# EAGLE design ai_hat_stellar (EAGLE 7.1.0)
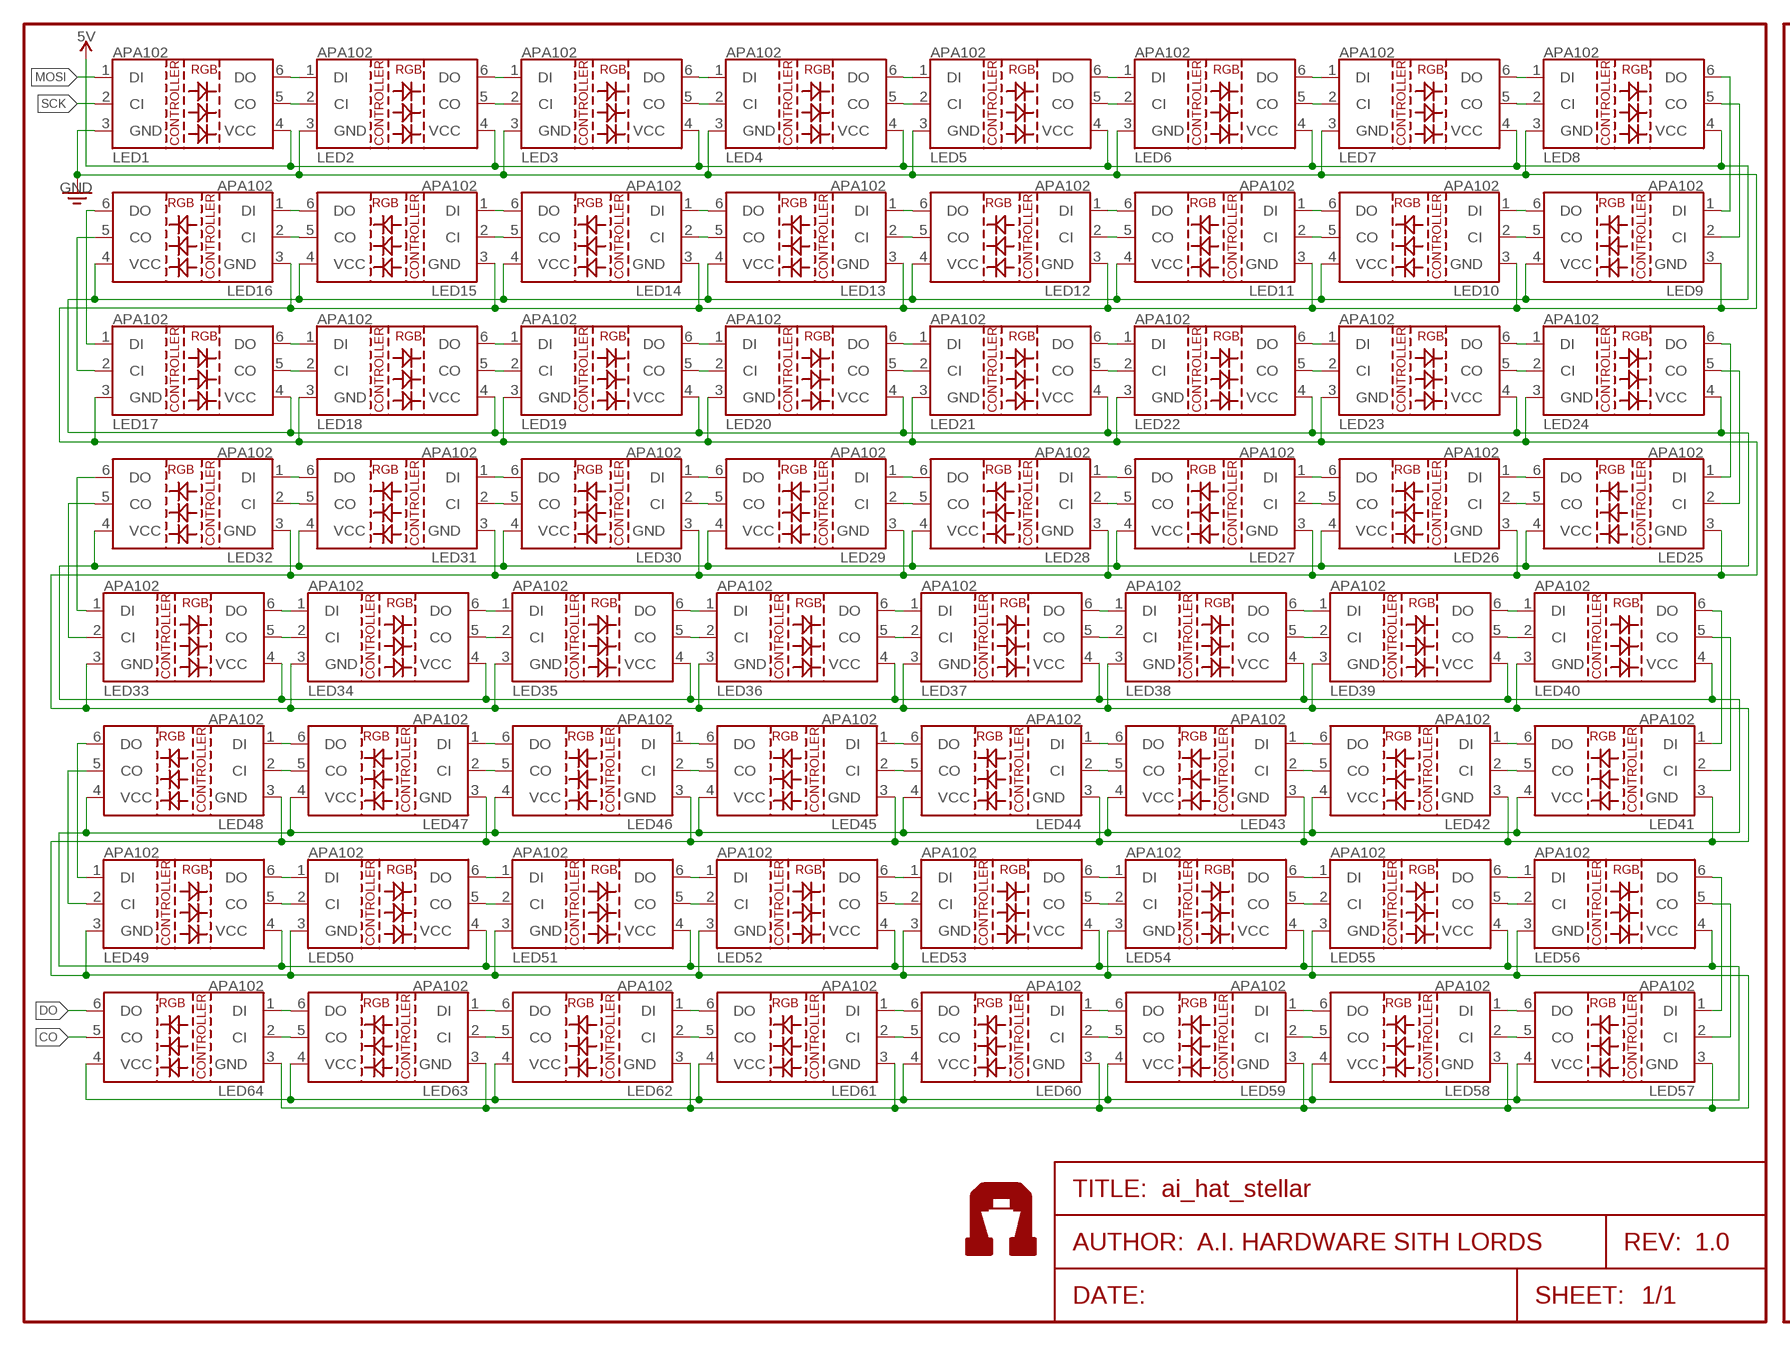
[diagram p0: schematic, sheet 1, part 1 of 2]
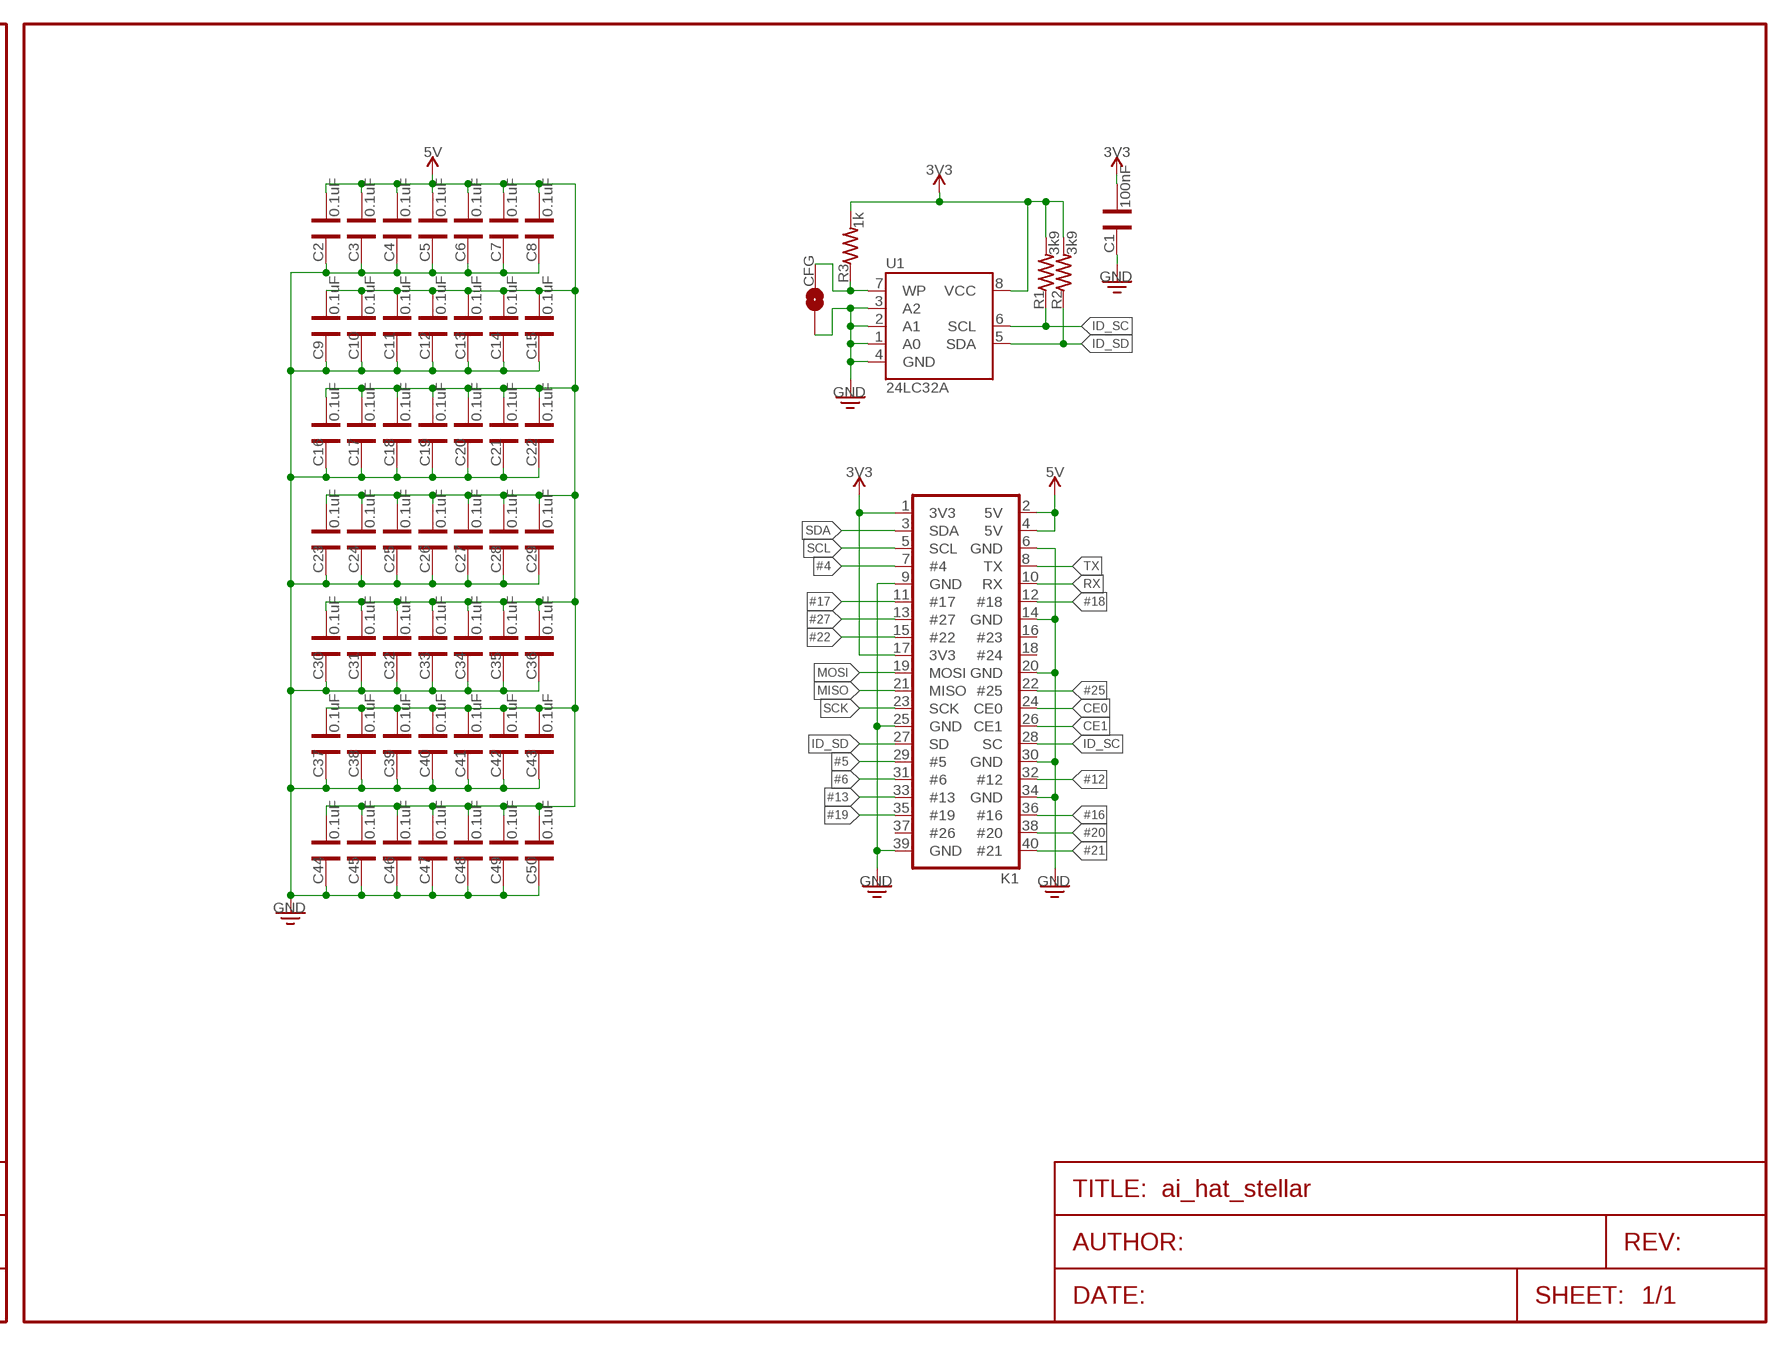
[diagram p1: schematic, sheet 1, part 2 of 2]
FRAME1 (FRAME-LETTER): AUTHOR: A.I. HARDWARE SITH LORDS; REV: 1.0

## Parts
C1  100nF  CAP0603  [CAP-0603]
C2  0.1uF  CAP0603  [CAP-0603]
C3  0.1uF  CAP0603  [CAP-0603]
C4  0.1uF  CAP0603  [CAP-0603]
C5  0.1uF  CAP0603  [CAP-0603]
C6  0.1uF  CAP0603  [CAP-0603]
C7  0.1uF  CAP0603  [CAP-0603]
C8  0.1uF  CAP0603  [CAP-0603]
C9  0.1uF  CAP0603  [CAP-0603]
C10  0.1uF  CAP0603  [CAP-0603]
C11  0.1uF  CAP0603  [CAP-0603]
C12  0.1uF  CAP0603  [CAP-0603]
C13  0.1uF  CAP0603  [CAP-0603]
C14  0.1uF  CAP0603  [CAP-0603]
C15  0.1uF  CAP0603  [CAP-0603]
C16  0.1uF  CAP0603  [CAP-0603]
C17  0.1uF  CAP0603  [CAP-0603]
C18  0.1uF  CAP0603  [CAP-0603]
C19  0.1uF  CAP0603  [CAP-0603]
C20  0.1uF  CAP0603  [CAP-0603]
C21  0.1uF  CAP0603  [CAP-0603]
C22  0.1uF  CAP0603  [CAP-0603]
C23  0.1uF  CAP0603  [CAP-0603]
C24  0.1uF  CAP0603  [CAP-0603]
C25  0.1uF  CAP0603  [CAP-0603]
C26  0.1uF  CAP0603  [CAP-0603]
C27  0.1uF  CAP0603  [CAP-0603]
C28  0.1uF  CAP0603  [CAP-0603]
C29  0.1uF  CAP0603  [CAP-0603]
C30  0.1uF  CAP0603  [CAP-0603]
C31  0.1uF  CAP0603  [CAP-0603]
C32  0.1uF  CAP0603  [CAP-0603]
C33  0.1uF  CAP0603  [CAP-0603]
C34  0.1uF  CAP0603  [CAP-0603]
C35  0.1uF  CAP0603  [CAP-0603]
C36  0.1uF  CAP0603  [CAP-0603]
C37  0.1uF  CAP0603  [CAP-0603]
C38  0.1uF  CAP0603  [CAP-0603]
C39  0.1uF  CAP0603  [CAP-0603]
C40  0.1uF  CAP0603  [CAP-0603]
C41  0.1uF  CAP0603  [CAP-0603]
C42  0.1uF  CAP0603  [CAP-0603]
C43  0.1uF  CAP0603  [CAP-0603]
C44  0.1uF  CAP0603  [CAP-0603]
C45  0.1uF  CAP0603  [CAP-0603]
C46  0.1uF  CAP0603  [CAP-0603]
C47  0.1uF  CAP0603  [CAP-0603]
C48  0.1uF  CAP0603  [CAP-0603]
C49  0.1uF  CAP0603  [CAP-0603]
C50  0.1uF  CAP0603  [CAP-0603]
CFG  1X02-SJ-NO  [1X02-SJ-NO]
K1  2X20-RPI  [2X20-RPI]
LED1  LED-APA102  [LED-APA102]
LED2  LED-APA102  [LED-APA102]
LED3  LED-APA102  [LED-APA102]
LED4  LED-APA102  [LED-APA102]
LED5  LED-APA102  [LED-APA102]
LED6  LED-APA102  [LED-APA102]
LED7  LED-APA102  [LED-APA102]
LED8  LED-APA102  [LED-APA102]
LED9  LED-APA102  [LED-APA102]
LED10  LED-APA102  [LED-APA102]
LED11  LED-APA102  [LED-APA102]
LED12  LED-APA102  [LED-APA102]
LED13  LED-APA102  [LED-APA102]
LED14  LED-APA102  [LED-APA102]
LED15  LED-APA102  [LED-APA102]
LED16  LED-APA102  [LED-APA102]
LED17  LED-APA102  [LED-APA102]
LED18  LED-APA102  [LED-APA102]
LED19  LED-APA102  [LED-APA102]
LED20  LED-APA102  [LED-APA102]
LED21  LED-APA102  [LED-APA102]
LED22  LED-APA102  [LED-APA102]
LED23  LED-APA102  [LED-APA102]
LED24  LED-APA102  [LED-APA102]
LED25  LED-APA102  [LED-APA102]
LED26  LED-APA102  [LED-APA102]
LED27  LED-APA102  [LED-APA102]
LED28  LED-APA102  [LED-APA102]
LED29  LED-APA102  [LED-APA102]
LED30  LED-APA102  [LED-APA102]
LED31  LED-APA102  [LED-APA102]
LED32  LED-APA102  [LED-APA102]
LED33  LED-APA102  [LED-APA102]
LED34  LED-APA102  [LED-APA102]
LED35  LED-APA102  [LED-APA102]
LED36  LED-APA102  [LED-APA102]
LED37  LED-APA102  [LED-APA102]
LED38  LED-APA102  [LED-APA102]
LED39  LED-APA102  [LED-APA102]
LED40  LED-APA102  [LED-APA102]
LED41  LED-APA102  [LED-APA102]
LED42  LED-APA102  [LED-APA102]
LED43  LED-APA102  [LED-APA102]
LED44  LED-APA102  [LED-APA102]
LED45  LED-APA102  [LED-APA102]
LED46  LED-APA102  [LED-APA102]
LED47  LED-APA102  [LED-APA102]
LED48  LED-APA102  [LED-APA102]
LED49  LED-APA102  [LED-APA102]
LED50  LED-APA102  [LED-APA102]
LED51  LED-APA102  [LED-APA102]
LED52  LED-APA102  [LED-APA102]
LED53  LED-APA102  [LED-APA102]
LED54  LED-APA102  [LED-APA102]
LED55  LED-APA102  [LED-APA102]
LED56  LED-APA102  [LED-APA102]
LED57  LED-APA102  [LED-APA102]
LED58  LED-APA102  [LED-APA102]
LED59  LED-APA102  [LED-APA102]
LED60  LED-APA102  [LED-APA102]
LED61  LED-APA102  [LED-APA102]
LED62  LED-APA102  [LED-APA102]
LED63  LED-APA102  [LED-APA102]
LED64  LED-APA102  [LED-APA102]
R1  3k9  RES0603  [RES-0603]
R2  3k9  RES0603  [RES-0603]
R3  1k  RES0603  [RES-0603]
U1  24LC32A  [SO08-EIAJ]
U$9  AI-LOGOXS  [AI-LOGO-XS]
U$10  AI-LOGOXS  [AI-LOGO-XS]

## Nets
3V3: C1.1 K1.1(3V3) K1.17(3V3) R1.2 R2.2 R3.2 U1.8(VCC)
5V: C2.1 C3.1 C4.1 C5.1 C6.1 C7.1 C8.1 C9.1 C10.1 C11.1 C12.1 C13.1 C14.1 C15.1 C16.1 C17.1 C18.1 C19.1 C20.1 C21.1 C22.1 C23.1 C24.1 C25.1 C26.1 C27.1 C28.1 C29.1 C30.1 C31.1 C32.1 C33.1 C34.1 C35.1 C36.1 C37.1 C38.1 C39.1 C40.1 C41.1 C42.1 C43.1 C44.1 C45.1 C46.1 C47.1 C48.1 C49.1 C50.1 K1.2(5V) K1.4(5V) LED1.4(VCC) LED2.4(VCC) LED3.4(VCC) LED4.4(VCC) LED5.4(VCC) LED6.4(VCC) LED7.4(VCC) LED8.4(VCC) LED9.4(VCC) LED10.4(VCC) LED11.4(VCC) LED12.4(VCC) LED13.4(VCC) LED14.4(VCC) LED15.4(VCC) LED16.4(VCC) LED17.4(VCC) LED18.4(VCC) LED19.4(VCC) LED20.4(VCC) LED21.4(VCC) LED22.4(VCC) LED23.4(VCC) LED24.4(VCC) LED25.4(VCC) LED26.4(VCC) LED27.4(VCC) LED28.4(VCC) LED29.4(VCC) LED30.4(VCC) LED31.4(VCC) LED32.4(VCC) LED33.4(VCC) LED34.4(VCC) LED35.4(VCC) LED36.4(VCC) LED37.4(VCC) LED38.4(VCC) LED39.4(VCC) LED40.4(VCC) LED41.4(VCC) LED42.4(VCC) LED43.4(VCC) LED44.4(VCC) LED45.4(VCC) LED46.4(VCC) LED47.4(VCC) LED48.4(VCC) LED49.4(VCC) LED50.4(VCC) LED51.4(VCC) LED52.4(VCC) LED53.4(VCC) LED54.4(VCC) LED55.4(VCC) LED56.4(VCC) LED57.4(VCC) LED58.4(VCC) LED59.4(VCC) LED60.4(VCC) LED61.4(VCC) LED62.4(VCC) LED63.4(VCC) LED64.4(VCC)
#4: K1.7(#4)
#5: K1.29(#5)
#6: K1.31(#6)
#12: K1.32(#12)
#13: K1.33(#13)
#16: K1.36(#16)
#17: K1.11(#17)
#18: K1.12(#18)
#19: K1.35(#19)
#20: K1.38(#20)
#21: K1.40(#21)
#22: K1.15(#22)
#25: K1.22(#25)
#27: K1.13(#27)
CE0: K1.24(CE0)
CE1: K1.26(CE1)
CO: LED64.5(CO)
DO: LED64.6(DO)
GND: C1.2 C2.2 C3.2 C4.2 C5.2 C6.2 C7.2 C8.2 C9.2 C10.2 C11.2 C12.2 C13.2 C14.2 C15.2 C16.2 C17.2 C18.2 C19.2 C20.2 C21.2 C22.2 C23.2 C24.2 C25.2 C26.2 C27.2 C28.2 C29.2 C30.2 C31.2 C32.2 C33.2 C34.2 C35.2 C36.2 C37.2 C38.2 C39.2 C40.2 C41.2 C42.2 C43.2 C44.2 C45.2 C46.2 C47.2 C48.2 C49.2 C50.2 CFG.1 K1.6(GND) K1.9(GND) K1.14(GND) K1.20(GND) K1.25(GND) K1.30(GND) K1.34(GND) K1.39(GND) LED1.3(GND) LED2.3(GND) LED3.3(GND) LED4.3(GND) LED5.3(GND) LED6.3(GND) LED7.3(GND) LED8.3(GND) LED9.3(GND) LED10.3(GND) LED11.3(GND) LED12.3(GND) LED13.3(GND) LED14.3(GND) LED15.3(GND) LED16.3(GND) LED17.3(GND) LED18.3(GND) LED19.3(GND) LED20.3(GND) LED21.3(GND) LED22.3(GND) LED23.3(GND) LED24.3(GND) LED25.3(GND) LED26.3(GND) LED27.3(GND) LED28.3(GND) LED29.3(GND) LED30.3(GND) LED31.3(GND) LED32.3(GND) LED33.3(GND) LED34.3(GND) LED35.3(GND) LED36.3(GND) LED37.3(GND) LED38.3(GND) LED39.3(GND) LED40.3(GND) LED41.3(GND) LED42.3(GND) LED43.3(GND) LED44.3(GND) LED45.3(GND) LED46.3(GND) LED47.3(GND) LED48.3(GND) LED49.3(GND) LED50.3(GND) LED51.3(GND) LED52.3(GND) LED53.3(GND) LED54.3(GND) LED55.3(GND) LED56.3(GND) LED57.3(GND) LED58.3(GND) LED59.3(GND) LED60.3(GND) LED61.3(GND) LED62.3(GND) LED63.3(GND) LED64.3(GND) U1.1(A0) U1.2(A1) U1.3(A2) U1.4(GND)
ID_SC: K1.28(SC) R1.1 U1.6(SCL)
ID_SD: K1.27(SD) R2.1 U1.5(SDA)
MISO: K1.21(MISO)
MOSI: K1.19(MOSI) LED1.1(DI)
N$1: LED8.5(CO) LED9.2(CI)
N$2: LED9.5(CO) LED10.2(CI)
N$3: CFG.2 R3.1 U1.7(WP)
N$4: LED8.6(DO) LED9.1(DI)
N$5: LED1.5(CO) LED2.2(CI)
N$6: LED1.6(DO) LED2.1(DI)
N$7: LED2.6(DO) LED3.1(DI)
N$8: LED2.5(CO) LED3.2(CI)
N$9: LED3.6(DO) LED4.1(DI)
N$10: LED3.5(CO) LED4.2(CI)
N$11: LED4.6(DO) LED5.1(DI)
N$12: LED4.5(CO) LED5.2(CI)
N$13: LED5.6(DO) LED6.1(DI)
N$14: LED5.5(CO) LED6.2(CI)
N$15: LED6.6(DO) LED7.1(DI)
N$16: LED6.5(CO) LED7.2(CI)
N$17: LED7.6(DO) LED8.1(DI)
N$18: LED7.5(CO) LED8.2(CI)
N$19: LED9.6(DO) LED10.1(DI)
N$20: LED10.6(DO) LED11.1(DI)
N$21: LED10.5(CO) LED11.2(CI)
N$22: LED11.6(DO) LED12.1(DI)
N$23: LED11.5(CO) LED12.2(CI)
N$24: LED12.6(DO) LED13.1(DI)
N$25: LED12.5(CO) LED13.2(CI)
N$26: LED13.6(DO) LED14.1(DI)
N$27: LED13.5(CO) LED14.2(CI)
N$28: LED14.6(DO) LED15.1(DI)
N$29: LED14.5(CO) LED15.2(CI)
N$30: LED15.6(DO) LED16.1(DI)
N$31: LED15.5(CO) LED16.2(CI)
N$32: LED17.5(CO) LED18.2(CI)
N$33: LED17.6(DO) LED18.1(DI)
N$34: LED18.6(DO) LED19.1(DI)
N$35: LED18.5(CO) LED19.2(CI)
N$36: LED19.6(DO) LED20.1(DI)
N$37: LED19.5(CO) LED20.2(CI)
N$38: LED20.6(DO) LED21.1(DI)
N$39: LED20.5(CO) LED21.2(CI)
N$40: LED21.6(DO) LED22.1(DI)
N$41: LED21.5(CO) LED22.2(CI)
N$42: LED22.6(DO) LED23.1(DI)
N$43: LED22.5(CO) LED23.2(CI)
N$44: LED23.6(DO) LED24.1(DI)
N$45: LED23.5(CO) LED24.2(CI)
N$46: LED16.6(DO) LED17.1(DI)
N$47: LED25.5(CO) LED26.2(CI)
N$48: LED25.6(DO) LED26.1(DI)
N$49: LED26.6(DO) LED27.1(DI)
N$50: LED26.5(CO) LED27.2(CI)
N$51: LED27.6(DO) LED28.1(DI)
N$52: LED27.5(CO) LED28.2(CI)
N$53: LED28.6(DO) LED29.1(DI)
N$54: LED28.5(CO) LED29.2(CI)
N$55: LED29.6(DO) LED30.1(DI)
N$56: LED29.5(CO) LED30.2(CI)
N$57: LED30.6(DO) LED31.1(DI)
N$58: LED30.5(CO) LED31.2(CI)
N$59: LED31.6(DO) LED32.1(DI)
N$60: LED31.5(CO) LED32.2(CI)
N$61: LED16.5(CO) LED17.2(CI)
N$62: LED33.5(CO) LED34.2(CI)
N$63: LED33.6(DO) LED34.1(DI)
N$64: LED34.6(DO) LED35.1(DI)
N$65: LED34.5(CO) LED35.2(CI)
N$66: LED35.6(DO) LED36.1(DI)
N$67: LED35.5(CO) LED36.2(CI)
N$68: LED36.6(DO) LED37.1(DI)
N$69: LED36.5(CO) LED37.2(CI)
N$70: LED37.6(DO) LED38.1(DI)
N$71: LED37.5(CO) LED38.2(CI)
N$72: LED38.6(DO) LED39.1(DI)
N$73: LED38.5(CO) LED39.2(CI)
N$74: LED39.6(DO) LED40.1(DI)
N$75: LED39.5(CO) LED40.2(CI)
N$76: LED24.6(DO) LED25.1(DI)
N$77: LED41.5(CO) LED42.2(CI)
N$78: LED41.6(DO) LED42.1(DI)
N$79: LED42.6(DO) LED43.1(DI)
N$80: LED42.5(CO) LED43.2(CI)
N$81: LED43.6(DO) LED44.1(DI)
N$82: LED43.5(CO) LED44.2(CI)
N$83: LED44.6(DO) LED45.1(DI)
N$84: LED44.5(CO) LED45.2(CI)
N$85: LED45.6(DO) LED46.1(DI)
N$86: LED45.5(CO) LED46.2(CI)
N$87: LED46.6(DO) LED47.1(DI)
N$88: LED46.5(CO) LED47.2(CI)
N$89: LED47.6(DO) LED48.1(DI)
N$90: LED47.5(CO) LED48.2(CI)
N$91: LED49.5(CO) LED50.2(CI)
N$92: LED49.6(DO) LED50.1(DI)
N$93: LED50.6(DO) LED51.1(DI)
N$94: LED50.5(CO) LED51.2(CI)
N$95: LED51.6(DO) LED52.1(DI)
N$96: LED51.5(CO) LED52.2(CI)
N$97: LED52.6(DO) LED53.1(DI)
N$98: LED52.5(CO) LED53.2(CI)
N$99: LED53.6(DO) LED54.1(DI)
N$100: LED53.5(CO) LED54.2(CI)
N$101: LED54.6(DO) LED55.1(DI)
N$102: LED54.5(CO) LED55.2(CI)
N$103: LED55.6(DO) LED56.1(DI)
N$104: LED55.5(CO) LED56.2(CI)
N$105: LED32.5(CO) LED33.2(CI)
N$106: LED57.5(CO) LED58.2(CI)
N$107: LED57.6(DO) LED58.1(DI)
N$108: LED58.6(DO) LED59.1(DI)
N$109: LED58.5(CO) LED59.2(CI)
N$110: LED59.6(DO) LED60.1(DI)
N$111: LED59.5(CO) LED60.2(CI)
N$112: LED60.6(DO) LED61.1(DI)
N$113: LED60.5(CO) LED61.2(CI)
N$114: LED61.6(DO) LED62.1(DI)
N$115: LED61.5(CO) LED62.2(CI)
N$116: LED62.6(DO) LED63.1(DI)
N$117: LED62.5(CO) LED63.2(CI)
N$118: LED63.6(DO) LED64.1(DI)
N$119: LED63.5(CO) LED64.2(CI)
N$120: LED32.6(DO) LED33.1(DI)
N$121: LED40.6(DO) LED41.1(DI)
N$122: LED40.5(CO) LED41.2(CI)
N$123: LED48.6(DO) LED49.1(DI)
N$124: LED24.5(CO) LED25.2(CI)
N$125: LED48.5(CO) LED49.2(CI)
N$126: LED56.6(DO) LED57.1(DI)
N$127: LED56.5(CO) LED57.2(CI)
RX: K1.10(RX)
SCK: K1.23(SCK) LED1.2(CI)
SCL: K1.5(SCL)
SDA: K1.3(SDA)
TX: K1.8(TX)
Unconnected: K1.16(#23) K1.18(#24) K1.37(#26)

## Library data of the parts
C1 = Ai_Passives:CAP; DIELECTRIC: X7R
C2-C50 = Ai_Passives:CAP
CFG = Ai_Connectors:1X02-SJ-NO: Solder Jumper SMD solder jumper: Normally Open and Normally Closed are the same, but have different paste layers. NC will have a large amount of paste and should jumper during reflow.
K1 = Ai_Connectors:2X20-RPI
LED1-LED64 = Ai_LED:LED-APA102
R1-R3 = Ai_Passives:RES: Part # blah Digikey; TOLERANCE: 5%
U1 = Ai_IC:24LC32A
U$9 U$10 = Ai_Miscellany:AI-LOGO

## Board
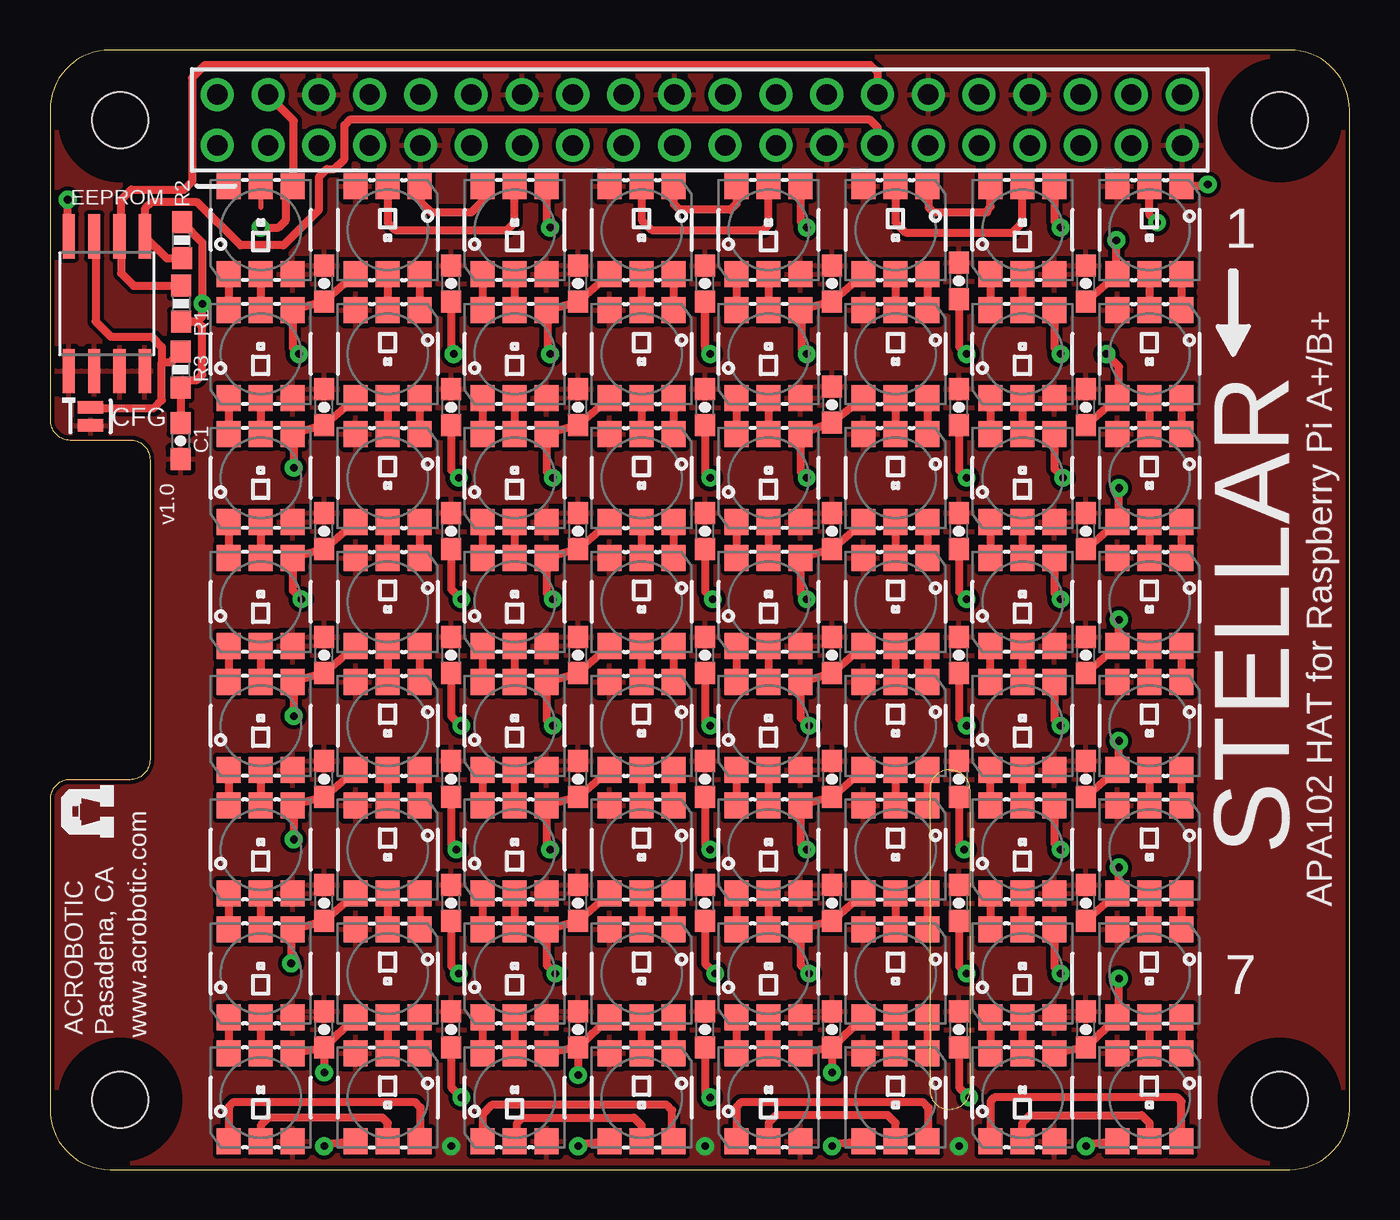
[diagram p2: board, top side]
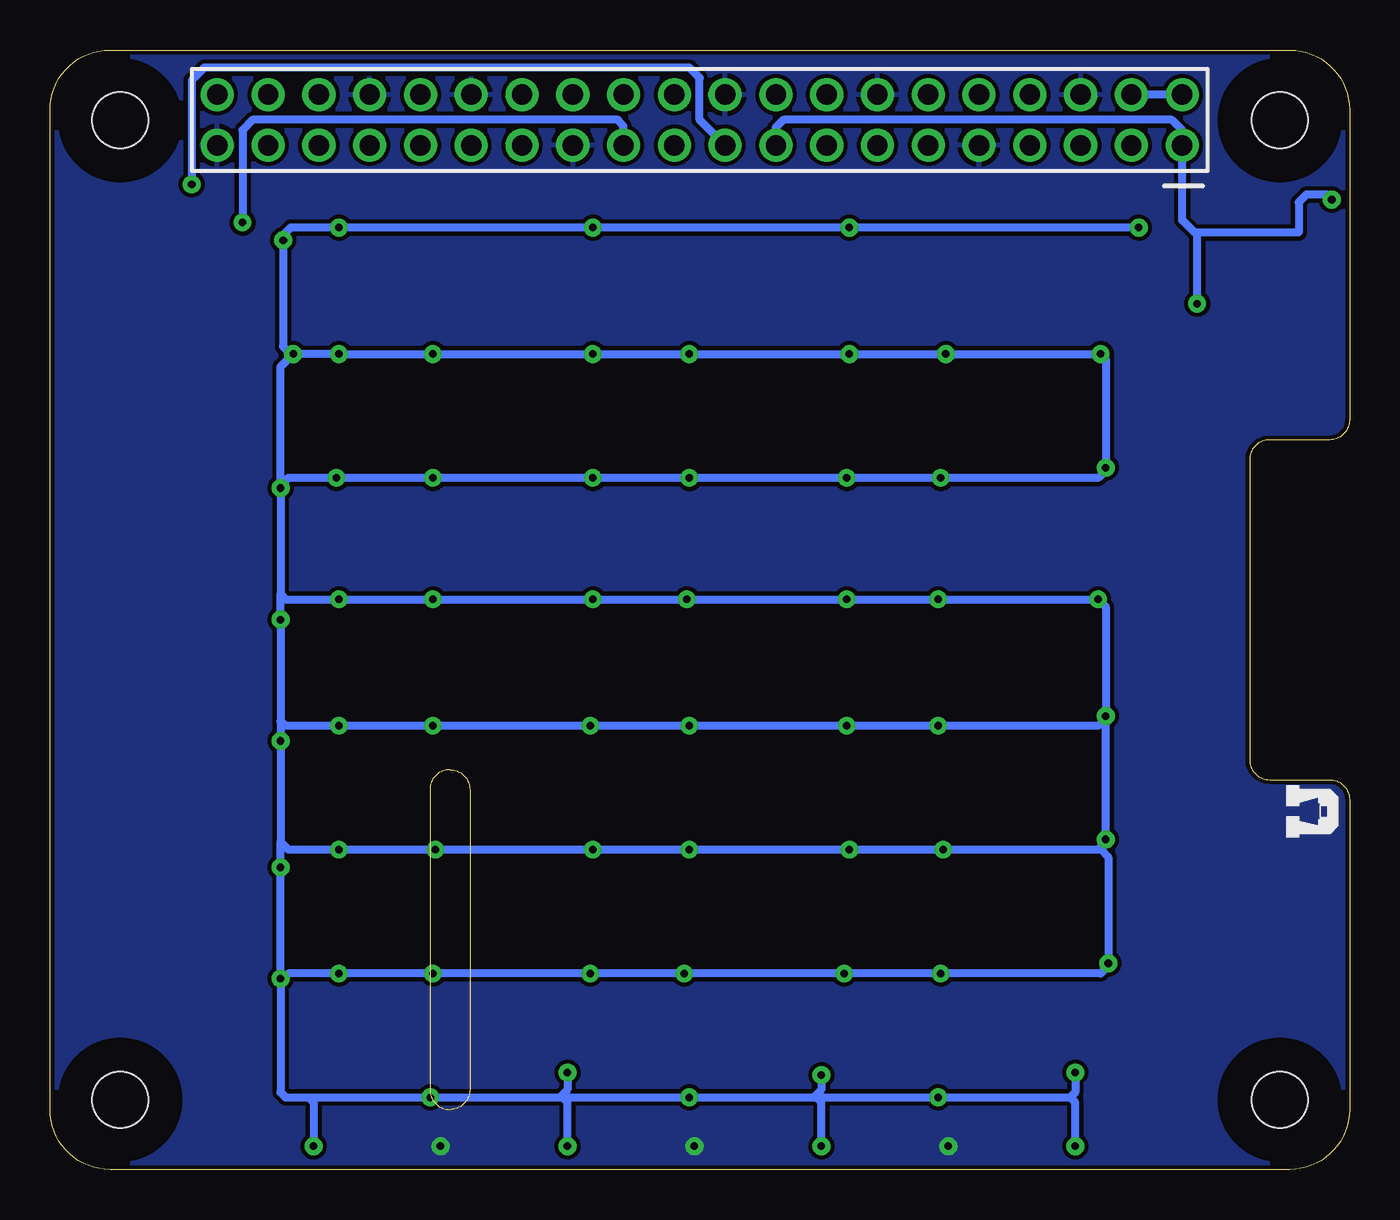
[diagram p3: board, bottom side, seen from below]

Size 65 x 56 mm. Coordinates in mm from the lower left corner, seen from the top.
Outline: 0,3 arc90 3,0 62,0 arc90 65,3 65,53 arc90 62,56 3,56 arc90 0,53 0,37.5 arc90 1,36.5 4,36.5 arc-90 5,35.5 5,20.5 arc-90 4,19.5 1,19.5 arc90 0,18.5 0,3
Copper layers (1*16): Top 0.035mm / dielectric 1.5mm / Bottom 0.035mm
Design rules "ai_2layer": minimum track width 7mil, minimum drill 15mil, track to track 8mil, track to pad 8mil, pad to pad 8mil, via to via 8mil, smd to smd 8mil, copper to edge 8mil, drill to drill 8mil, minimum pad ring 12mil, minimum via ring 10mil, stop-mask expansion 4mil, vias tented up to drill 20mil, thermal gap 10mil
Holes 2.8 mm at 3.5,3.5 3.5,52.5 61.5,52.5 61.5,3.5
tRestrict: area 1.9,51 to 5,54; area 60,51 to 63,54; area 60,1.9 to 63,5; area 1.9,1.9 to 5,5
bRestrict: area 1.9,1.9 to 5,5; area 1.9,51 to 5,54; area 60,1.9 to 63,5; area 60,51 to 63,54
Milling: 6 lines

### Footprints (pad centres in the part's own frame; a part is rotated, then mirrored left to right if it is on the bottom)
CAP-0603 = smd 1.1 x 1: 1 -0.9,0; 2 0.9,0
1X02-SJ-NO = smd 0.635 x 1.27: 1 -0.45,0; 2 0.45,0
2X20-RPI = drill 1.016 pad 1.651: 1 -24.13,-1.27; 2 -24.13,1.27; 3 -21.59,-1.27; 4 -21.59,1.27; 5 -19.05,-1.27; 6 -19.05,1.27; 7 -16.51,-1.27; 8 -16.51,1.27; 9 -13.97,-1.27; 10 -13.97,1.27; 11 -11.43,-1.27; 12 -11.43,1.27; 13 -8.89,-1.27; 14 -8.89,1.27; 15 -6.35,-1.27; 16 -6.35,1.27; 17 -3.81,-1.27; 18 -3.81,1.27; 19 -1.27,-1.27; 20 -1.27,1.27; 21 1.27,-1.27; 22 1.27,1.27; 23 3.81,-1.27; 24 3.81,1.27; 25 6.35,-1.27; 26 6.35,1.27; 27 8.89,-1.27; 28 8.89,1.27; 29 11.43,-1.27; 30 11.43,1.27; 31 13.97,-1.27; 32 13.97,1.27; 33 16.51,-1.27; 34 16.51,1.27; 35 19.05,-1.27; 36 19.05,1.27; 37 21.59,-1.27; 38 21.59,1.27; 39 24.13,-1.27; 40 24.13,1.27
LED-APA102 = smd 1.3 x 1.2: 1 -2.2,1.6; 2 -2.2,0; 3 -2.2,-1.6; 4 2.2,-1.6; 5 2.2,0; 6 2.2,1.6
RES-0603 = smd 1.1 x 1: 1 -0.9,0; 2 0.9,0
SO08-EIAJ = smd 0.61 x 2.21: 1 -1.905,-3.378; 2 -0.635,-3.378; 3 0.635,-3.378; 4 1.905,-3.378; 5 1.905,3.353; 6 0.635,3.353; 7 -0.635,3.353; 8 -1.905,3.353

### Placement (x,y rotation side)
C1  6.53,36.45 270 top
C2  51.82,44.32 90 top
C3  51.82,38.13 90 top
C4  51.82,31.93 90 top
C5  51.82,25.73 90 top
C6  51.82,19.53 90 top
C7  51.82,13.34 90 top
C8  51.82,7.01 90 top
C9  45.47,7.01 90 top
C10  45.47,13.34 90 top
C11  45.47,19.53 90 top
C12  45.47,25.73 90 top
C13  45.47,31.93 90 top
C14  45.47,38.13 90 top
C15  45.47,44.45 90 top
C16  39.12,44.32 90 top
C17  39.12,38.25 90 top
C18  39.12,31.93 90 top
C19  39.12,25.73 90 top
C20  39.12,19.53 90 top
C21  39.12,13.34 90 top
C22  39.12,7.01 90 top
C23  32.77,7.01 90 top
C24  32.77,13.34 90 top
C25  32.77,19.53 90 top
C26  32.77,25.73 90 top
C27  32.77,31.93 90 top
C28  32.77,38.13 90 top
C29  32.77,44.32 90 top
C30  26.42,44.32 90 top
C31  26.42,38.13 90 top
C32  26.42,31.93 90 top
C33  26.42,25.73 90 top
C34  26.42,19.53 90 top
C35  26.42,13.34 90 top
C36  26.42,7.01 90 top
C37  20.07,7.01 90 top
C38  20.07,13.34 90 top
C39  20.07,19.53 90 top
C40  20.07,25.73 90 top
C41  20.07,31.93 90 top
C42  20.07,38.13 90 top
C43  20.07,44.32 90 top
C44  13.72,44.32 90 top
C45  13.72,38.13 90 top
C46  13.72,31.93 90 top
C47  13.72,25.73 90 top
C48  13.72,19.53 90 top
C49  13.72,13.34 90 top
C50  13.72,7.01 90 top
CFG  2.03,37.67 90 top
K1  32.5,52.5 0 top
LED1  54.99,46.99 270 top
LED2  54.99,40.79 270 top
LED3  54.99,34.59 270 top
LED4  54.99,28.4 270 top
LED5  54.99,22.2 270 top
LED6  54.99,16 270 top
LED7  54.99,9.8 270 top
LED8  54.99,3.61 270 top
LED9  48.64,3.61 90 top
LED10  48.64,9.8 90 top
LED11  48.64,16 90 top
LED12  48.64,22.2 90 top
LED13  48.64,28.4 90 top
LED14  48.64,34.59 90 top
LED15  48.64,40.79 90 top
LED16  48.64,46.99 90 top
LED17  42.29,46.99 270 top
LED18  42.29,40.79 270 top
LED19  42.29,34.59 270 top
LED20  42.29,28.4 270 top
LED21  42.29,22.2 270 top
LED22  42.29,16 270 top
LED23  42.29,9.8 270 top
LED24  42.29,3.61 270 top
LED25  35.94,3.61 90 top
LED26  35.94,9.8 90 top
LED27  35.94,16 90 top
LED28  35.94,22.2 90 top
LED29  35.94,28.4 90 top
LED30  35.94,34.59 90 top
LED31  35.94,40.79 90 top
LED32  35.94,46.99 90 top
LED33  29.59,46.99 270 top
LED34  29.59,40.79 270 top
LED35  29.59,34.59 270 top
LED36  29.59,28.4 270 top
LED37  29.59,22.2 270 top
LED38  29.59,16 270 top
LED39  29.59,9.8 270 top
LED40  29.59,3.61 270 top
LED41  23.24,3.61 90 top
LED42  23.24,9.8 90 top
LED43  23.24,16 90 top
LED44  23.24,22.2 90 top
LED45  23.24,28.4 90 top
LED46  23.24,34.59 90 top
LED47  23.24,40.79 90 top
LED48  23.24,46.99 90 top
LED49  16.89,46.99 270 top
LED50  16.89,40.79 270 top
LED51  16.89,34.59 270 top
LED52  16.89,28.4 270 top
LED53  16.89,22.2 270 top
LED54  16.89,16 270 top
LED55  16.89,9.8 270 top
LED56  16.89,3.61 270 top
LED57  10.54,3.61 90 top
LED58  10.54,9.8 90 top
LED59  10.54,16 90 top
LED60  10.54,22.2 90 top
LED61  10.54,28.4 90 top
LED62  10.54,34.59 90 top
LED63  10.54,40.79 90 top
LED64  10.54,46.99 90 top
R1  6.55,43.31 270 top
R2  6.6,46.48 90 top
R3  6.53,40.01 270 top
U1  2.84,43.32 0 top
U$9  3.17,16.64 90 top
U$10  3.17,19.18 270 bottom

### Tracks (layer width: path | path; a pad name or v marks a point on that pad's centre or on a via)
3V3  (via drill 0.38)
  Top 0.406: R2.2 7.62,46.37 v7.62,43.31 7.62,42.67 7.37,42.42 6.62,42.42 R1.2 7.38,42.41 7.62,42.16 7.62,39.75 7.37,39.5 6.62,39.5 R3.2 C1.1 | U1.8 0.89,46.72 v0.89,48.51
  Bottom 0.406: K1.17 28.7,51.24 28.7,52.12 28.32,52.5 8.89,52.5 8.37,51.98 K1.1 8.37,47.49 7.75,46.86 7.62,46.86 | 7.62,46.86 2.54,46.86 2.54,48.39 2.16,48.77 1.14,48.77 v0.89,48.51 | v7.62,43.31 7.62,46.86
5V  (via drill 0.38)
  Top 0.406: C5.1 LED4.4 53.47,26.2 v53.47,27.51 | C6.1 LED5.4 53.47,20.08 v53.47,21.44 | C7.1 LED6.4 53.47,13.88 v53.47,15.11 | LED9.4 C8.1 LED7.4 53.47,7.68 v53.47,9.55 | C22.1 LED23.4 | LED22.4 C21.1 LED26.4 37.54,10.24 v37.97,9.8 | LED21.4 C20.1 LED27.4 37.54,16.31 v37.85,16 | LED20.4 C19.1 LED28.4 37.54,22.61 v37.97,22.2 | LED19.4 C18.1 LED29.4 37.54,28.83 v37.85,28.52 | LED18.4 C17.1 LED30.4 37.54,34.9 v37.85,34.59 | LED17.4 C16.1 LED31.4 37.59,42.92 37.59,41.05 v37.85,40.79 | C22.1 LED25.4 | LED39.4 C36.1 | C36.1 LED41.4 | LED38.4 C35.1 LED42.4 24.84,10.24 v25.27,9.8 | LED37.4 C34.1 LED43.4 24.84,16.18 v25.02,16 | LED36.4 C33.1 LED44.4 24.84,22.48 v25.15,22.2 | LED35.4 C32.1 LED45.4 24.84,28.83 v25.15,28.52 | LED34.4 C31.1 LED46.4 24.84,34.9 v25.15,34.59 | LED33.4 C30.1 LED47.4 24.89,42.92 24.89,40.92 v25.02,40.79 | LED49.4 C44.1 LED63.4 12.14,41.1 v12.45,40.79 | LED51.4 C46.1 LED61.4 12.14,28.96 v12.57,28.52 | LED52.4 C47.1 LED60.4 12.19,24.37 v12.19,22.68 | LED53.4 C48.1 LED59.4 12.19,18.18 v12.19,16.51 | LED54.4 C49.1 LED58.4 12.06,11.9 v12.06,10.31 | LED57.4 C50.1 | C50.1 LED55.4 | K1.4 10.91,53.73 12.19,52.45 12.19,49.24 LED64.4 11.81,48.86 11.81,47.5 11.43,47.12 v10.54,47.12 | 50.29,42.92 LED15.4 50.24,41.1 v50.55,40.79 | LED50.4 C45.1 LED62.4 12.19,36.77 v12.19,35.1 | 32.77,41.17 C29.1 32.77,41.05 v33.02,40.79 | 20.07,41.17 C43.1 20.07,40.92 v20.19,40.79 | LED56.4 13.8,1.25 v13.72,1.17 | LED40.4 26.5,1.25 v26.42,1.17 | LED8.4 51.9,1.25 v51.82,1.17 | LED24.4 39.2,1.25 v39.12,1.17 | LED48.4 24.84,47.3 v25.02,47.12 | LED32.4 37.54,47.42 v37.85,47.12 | LED16.4 50.24,47.42 v50.55,47.12 | v53.34,46.48 53.34,44.79 LED1.4 C2.1
  Top 0.406: C15.1 45.47,41.17 v45.85,40.79 | C42.1 20.07,34.98 v20.45,34.59 | C14.1 45.47,34.98 v45.85,34.59 | C41.1 20.07,29.03 v20.57,28.52 | C27.1 32.77,28.91 v33.15,28.52 | C13.1 45.47,28.91 v45.85,28.52 | C12.1 45.47,22.55 v45.85,22.2 | C26.1 32.77,22.43 v33.02,22.2 | C40.1 20.07,22.68 v20.57,22.2 | C28.1 32.77,34.85 v33.02,34.59 | v53.47,34.09 53.47,32.4 LED3.4 C4.1 | C39.1 20.07,16.26 v20.32,16 | C25.1 32.77,16.26 v33.02,16 | C11.1 45.47,16.26 v45.72,16 | LED14.4 50.24,35.03 v50.67,34.59 | v52.83,40.79 53.47,40.16 53.47,38.67 LED2.4 C3.1 | LED13.4 50.24,28.83 v50.55,28.52 | LED12.4 50.24,22.48 v50.55,22.2 | LED11.4 50.24,16.31 v50.55,16 | C38.1 20.07,10.19 v20.45,9.8 | C24.1 32.77,10.31 v33.27,9.8 | C10.1 45.47,10.19 v45.85,9.8 | LED10.4 50.24,10.11 v50.55,9.8 | C50.1 v13.72,4.85 | C37.1 20.07,4.12 v20.57,3.61 | C36.1 v26.42,4.72 | C23.1 32.77,3.86 v33.02,3.61 | C22.1 v39.12,4.85 | C9.1 45.47,4.12 v45.97,3.61
  Bottom 0.406: K1.2 K1.4 | v13.72,1.17 13.72,3.35 13.97,3.61 | v10.54,47.12 v25.02,47.12 v37.85,47.12 v50.55,47.12 52.96,47.12 53.34,46.74 v53.34,46.48 53.34,41.17 52.96,40.79 v52.83,40.79 | v12.19,35.1 12.19,40.54 v12.45,40.79 v20.19,40.79 v25.02,40.79 v33.02,40.79 v37.85,40.79 v45.85,40.79 v50.55,40.79 v52.83,40.79 | v12.19,35.1 12.19,34.98 12.57,34.59 v20.45,34.59 v25.15,34.59 v33.02,34.59 v37.85,34.59 v45.85,34.59 v50.67,34.59 53.09,34.59 53.47,34.21 | 53.47,34.21 v53.47,34.09 53.47,28.78 | 53.47,28.78 53.21,28.52 v50.55,28.52 v45.85,28.52 v37.85,28.52 v33.15,28.52 v25.15,28.52 v20.57,28.52 v12.57,28.52 12.19,28.14 v12.19,22.68 | 53.47,22.43 v53.47,27.51 53.47,28.78 | 53.47,22.43 v53.47,21.44 53.47,16.38 | 53.47,16.38 53.09,16 v50.55,16 v45.72,16 v37.85,16 v33.02,16 v25.02,16 v20.32,16 12.57,16 | 12.57,16 12.45,16 | 12.45,16 12.06,15.62 v12.06,10.31 12.06,10.19 12.45,9.8 v20.45,9.8 v25.27,9.8 v33.27,9.8 v37.97,9.8 v45.85,9.8 v50.55,9.8 53.09,9.8 53.47,9.42 | 53.47,9.42 53.47,3.86 53.21,3.61 52.07,3.61 | 52.07,3.61 v45.97,3.61 39.5,3.61 | 39.5,3.61 39.37,3.61 | 39.37,3.61 v33.02,3.61 26.8,3.61 | 26.8,3.61 26.67,3.61 | 26.67,3.61 v20.57,3.61 13.97,3.61 | v26.42,1.17 26.42,3.35 26.67,3.61 | 52.07,3.61 51.82,3.35 v51.82,1.17 | v39.12,1.17 39.12,3.35 39.37,3.61 | v12.19,35.1 12.19,35.23 | v12.19,22.68 12.19,22.55 12.57,22.2 v20.57,22.2 v25.15,22.2 v33.02,22.2 v37.97,22.2 v45.85,22.2 v50.55,22.2 53.21,22.2 53.47,22.43 | 12.45,16 12.45,16.13 | 12.45,16.13 12.19,16.38 v12.19,16.51 v12.19,22.68 | 53.47,34.21 53.47,40.16 v52.83,40.79 | 53.47,9.42 v53.47,9.55 v53.47,15.11 53.47,16.38
  Bottom 0.406: 12.45,16.13 12.57,16 | v13.72,4.85 13.72,3.86 13.97,3.61 | v26.42,4.72 26.42,3.99 26.8,3.61 | v39.12,4.85 39.12,3.99 39.5,3.61
CO
  Top 0.254: LED64.5 10.54,48.13
GND  (via drill 0.38)
  other vias: 45.47,1.17 32.77,1.17 20.07,1.17
  pour Top: 0,3 arc90 3,0 62,0 arc90 65,3 65,53 arc90 62,56 3,56 arc90 0,53 0,37.5 arc90 1,36.5 4,36.5 arc-90 5,35.5 5,20.5 arc-90 4,19.5 1,19.5 arc90 0,18.5
  pour Bottom: 0,3 arc90 3,0 62,0 arc90 65,3 65,53 arc90 62,56 3,56 arc90 0,53 0,37.5 arc90 1,36.5 4,36.5 arc-90 5,35.5 5,20.5 arc-90 4,19.5 1,19.5 arc90 0,18.5
ID_SC
  Top 0.406: K1.28 41.4,53.78 41.4,54.86 41.02,55.24 7.75,55.24 7.11,54.61 7.11,49.4 6.73,49.02 4.06,49.02 3.56,48.51 3.56,46.75 U1.6 3.56,46.59 3.56,44.83 4.18,44.21 R1.1
ID_SD
  Top 0.406: R2.1 5.84,45.58 U1.5 4.75,48.05 5.08,48.39 7.37,48.39 9.53,46.23 11.68,46.23 13.46,48.01 13.46,49.66 13.84,50.04 14.22,50.04 14.73,50.55 14.73,52.25 14.99,52.5 41.02,52.5 41.4,52.12 41.4,51.24 K1.27
MOSI  (via drill 0.38)
  Top 0.406: v57.91,49.28 57.83,49.19 LED1.1
  Bottom 0.406: K1.19 32.51,52.51 32.51,54.61 33.02,55.12 57.28,55.12 57.91,54.48 v57.91,49.28
N$1
  Top 0.406: LED9.2 48.64,2.34 49.02,2.72 54.61,2.72 54.99,2.34 LED8.5
N$2
  Top 0.406: LED10.2 LED9.5
N$3
  Top 0.406: U1.7 2.29,46.59 2.29,42.42 3.05,41.66 5.08,41.66 5.59,41.15 5.59,40.39 | CFG.2 2.05,38.1 5.21,38.1 5.59,38.48 5.59,40.39 | 5.59,40.39 6.1,40.39 6.1,40.47 R3.1
N$4
  Top 0.406: LED8.6 56.59,3.4 56.39,3.61 47.24,3.61 47.04,3.4 LED9.1
N$5
  Top 0.406: LED1.5 LED2.2
N$6
  Top 0.406: LED1.6 LED2.1
N$7
  Top 0.406: LED2.6 LED3.1
N$8
  Top 0.406: LED2.5 LED3.2
N$9
  Top 0.406: LED3.6 LED4.1
N$10
  Top 0.406: LED3.5 LED4.2
N$11
  Top 0.406: LED4.6 LED5.1
N$12
  Top 0.406: LED4.5 LED5.2
N$13
  Top 0.406: LED5.6 LED6.1
N$14
  Top 0.406: LED5.5 LED6.2
N$15
  Top 0.406: LED6.6 LED7.1
N$16
  Top 0.406: LED6.5 LED7.2
N$17
  Top 0.406: LED7.6 LED8.1
N$18
  Top 0.406: LED7.5 LED8.2
N$19
  Top 0.406: LED10.1 LED9.6
N$20
  Top 0.406: LED11.1 LED10.6
N$21
  Top 0.406: LED11.2 LED10.5
N$22
  Top 0.406: LED11.6 LED12.1
N$23
  Top 0.406: LED11.5 LED12.2
N$24
  Top 0.406: LED12.6 LED13.1
N$25
  Top 0.406: LED13.2 LED12.5
N$26
  Top 0.406: LED14.1 LED13.6
N$27
  Top 0.406: LED14.2 LED13.5
N$28
  Top 0.406: LED15.1 LED14.6
N$29
  Top 0.406: LED15.2 LED14.5
N$30
  Top 0.406: LED16.1 LED15.6
N$31
  Top 0.406: LED16.2 LED15.5
N$32
  Top 0.406: LED17.5 LED18.2
N$33
  Top 0.406: LED17.6 LED18.1
N$34
  Top 0.406: LED18.6 LED19.1
N$35
  Top 0.406: LED18.5 LED19.2
N$36
  Top 0.406: LED19.6 LED20.1
N$37
  Top 0.406: LED19.5 LED20.2
N$38
  Top 0.406: LED20.6 LED21.1
N$39
  Top 0.406: LED20.5 LED21.2
N$40
  Top 0.406: LED21.6 LED22.1
N$41
  Top 0.406: LED21.5 LED22.2
N$42
  Top 0.406: LED22.6 LED23.1
N$43
  Top 0.406: LED22.5 LED23.2
N$44
  Top 0.406: LED23.6 LED24.1
N$45
  Top 0.406: LED23.5 LED24.2
N$46
  Top 0.406: LED17.1 43.94,49.14 43.94,48.13 44.2,47.88 46.86,47.88 47.04,48.18 LED16.6
N$47
  Top 0.406: LED26.2 LED25.5
N$48
  Top 0.406: LED26.1 LED25.6
N$49
  Top 0.406: LED27.1 LED26.6
N$50
  Top 0.406: LED27.2 LED26.5
N$51
  Top 0.406: LED28.1 LED27.6
N$52
  Top 0.406: LED28.2 LED27.5
N$53
  Top 0.406: LED29.1 LED28.6
N$54
  Top 0.406: LED29.2 LED28.5
N$55
  Top 0.406: LED30.1 LED29.6
N$56
  Top 0.406: LED30.2 LED29.5
N$57
  Top 0.406: LED31.1 LED30.6
N$58
  Top 0.406: LED31.2 LED30.5
N$59
  Top 0.406: LED32.1 LED31.6
N$60
  Top 0.406: LED32.2 LED31.5
N$61
  Top 0.406: LED17.2 42.29,47.37 42.8,46.86 48.13,46.86 48.64,47.37 LED16.5
N$62
  Top 0.406: LED33.5 LED34.2
N$63
  Top 0.406: LED33.6 LED34.1
N$64
  Top 0.406: LED34.6 LED35.1
N$65
  Top 0.406: LED34.5 LED35.2
N$66
  Top 0.406: LED35.6 LED36.1
N$67
  Top 0.406: LED35.5 LED36.2
N$68
  Top 0.406: LED36.6 LED37.1
N$69
  Top 0.406: LED36.5 LED37.2
N$70
  Top 0.406: LED37.6 LED38.1
N$71
  Top 0.406: LED37.5 LED38.2
N$72
  Top 0.406: LED38.6 LED39.1
N$73
  Top 0.406: LED38.5 LED39.2
N$74
  Top 0.406: LED39.6 LED40.1
N$75
  Top 0.406: LED39.5 LED40.2
N$76
  Top 0.406: LED24.6 43.94,1.3 43.94,3.1 43.69,3.35 34.54,3.35 34.34,3.15 LED25.1
N$77
  Top 0.406: LED42.2 LED41.5
N$78
  Top 0.406: LED42.1 LED41.6
N$79
  Top 0.406: LED43.1 LED42.6
N$80
  Top 0.406: LED43.2 LED42.5
N$81
  Top 0.406: LED44.1 LED43.6
N$82
  Top 0.406: LED44.2 LED43.5
N$83
  Top 0.406: LED45.1 LED44.6
N$84
  Top 0.406: LED45.2 LED44.5
N$85
  Top 0.406: LED46.1 LED45.6
N$86
  Top 0.406: LED46.2 LED45.5
N$87
  Top 0.406: LED47.1 LED46.6
N$88
  Top 0.406: LED47.2 LED46.5
N$89
  Top 0.406: LED48.1 LED47.6
N$90
  Top 0.406: LED48.2 LED47.5
N$91
  Top 0.406: LED49.5 LED50.2
N$92
  Top 0.406: LED49.6 LED50.1
N$93
  Top 0.406: LED50.6 LED51.1
N$94
  Top 0.406: LED50.5 LED51.2
N$95
  Top 0.406: LED51.6 LED52.1
N$96
  Top 0.406: LED51.5 LED52.2
N$97
  Top 0.406: LED52.6 LED53.1
N$98
  Top 0.406: LED52.5 LED53.2
N$99
  Top 0.406: LED53.6 LED54.1
N$100
  Top 0.406: LED53.5 LED54.2
N$101
  Top 0.406: LED54.6 LED55.1
N$102
  Top 0.406: LED54.5 LED55.2
N$103
  Top 0.406: LED55.6 LED56.1
N$104
  Top 0.406: LED55.5 LED56.2
N$105
  Top 0.406: LED33.2 29.59,47.5 30.1,46.99 35.69,46.99 35.94,47.24 LED32.5
N$106
  Top 0.406: LED58.2 LED57.5
N$107
  Top 0.406: LED58.1 LED57.6
N$108
  Top 0.406: LED59.1 LED58.6
N$109
  Top 0.406: LED59.2 LED58.5
N$110
  Top 0.406: LED60.1 LED59.6
N$111
  Top 0.406: LED60.2 LED59.5
N$112
  Top 0.406: LED61.1 LED60.6
N$113
  Top 0.406: LED61.2 LED60.5
N$114
  Top 0.406: LED62.1 LED61.6
N$115
  Top 0.406: LED62.2 LED61.5
N$116
  Top 0.406: LED63.1 LED62.6
N$117
  Top 0.406: LED63.2 LED62.5
N$118
  Top 0.406: LED64.1 LED63.6
N$119
  Top 0.406: LED64.2 LED63.5
N$120
  Top 0.406: LED32.6 34.34,48.31 34.04,48.01 31.5,48.01 31.19,48.31 LED33.1
N$121
  Top 0.406: LED40.6 31.11,1.33 31.11,2.97 30.86,3.23 22.1,3.23 21.64,2.77 LED41.1
N$122
  Top 0.406: LED41.2 23.37,1.38 23.37,2.34 23.62,2.59 29.21,2.59 29.59,2.21 LED40.5
N$123
  Top 0.406: LED49.1 18.54,49.14 18.54,48.39 19.05,47.88 21.08,47.88 21.64,48.44 LED48.6
N$124
  Top 0.406: LED24.5 42.29,2.34 41.91,2.72 36.32,2.72 35.94,2.34 LED25.2
N$125
  Top 0.406: LED49.2 16.89,47.37 17.27,46.99 22.86,46.99 23.24,47.37 LED48.5
N$126
  Top 0.406: LED56.6 18.54,1.3 18.54,3.1 18.29,3.35 9.14,3.35 8.94,3.15 LED57.1
N$127
  Top 0.406: LED56.5 16.89,2.34 16.64,2.59 10.92,2.59 10.54,2.21 LED57.2
SCK  (via drill 0.38)
  Top 0.406: v55.37,47.37 54.99,47.75 LED1.2
  Bottom 0.406: K1.23 36.32,51.24 36.32,52.2 36.58,52.5 54.86,52.5 55.37,51.99 v55.37,47.37

### Text on the board
tPlace: EEPROM | 1 | STELLAR | CFG | v1.0 | APA102 HAT for Raspberry Pi A+/B+ | 7 | ACROBOTIC | Pasadena, CA | www.acrobotic.com